# EAGLE design GregsBoard1 (EAGLE 8.6.0)
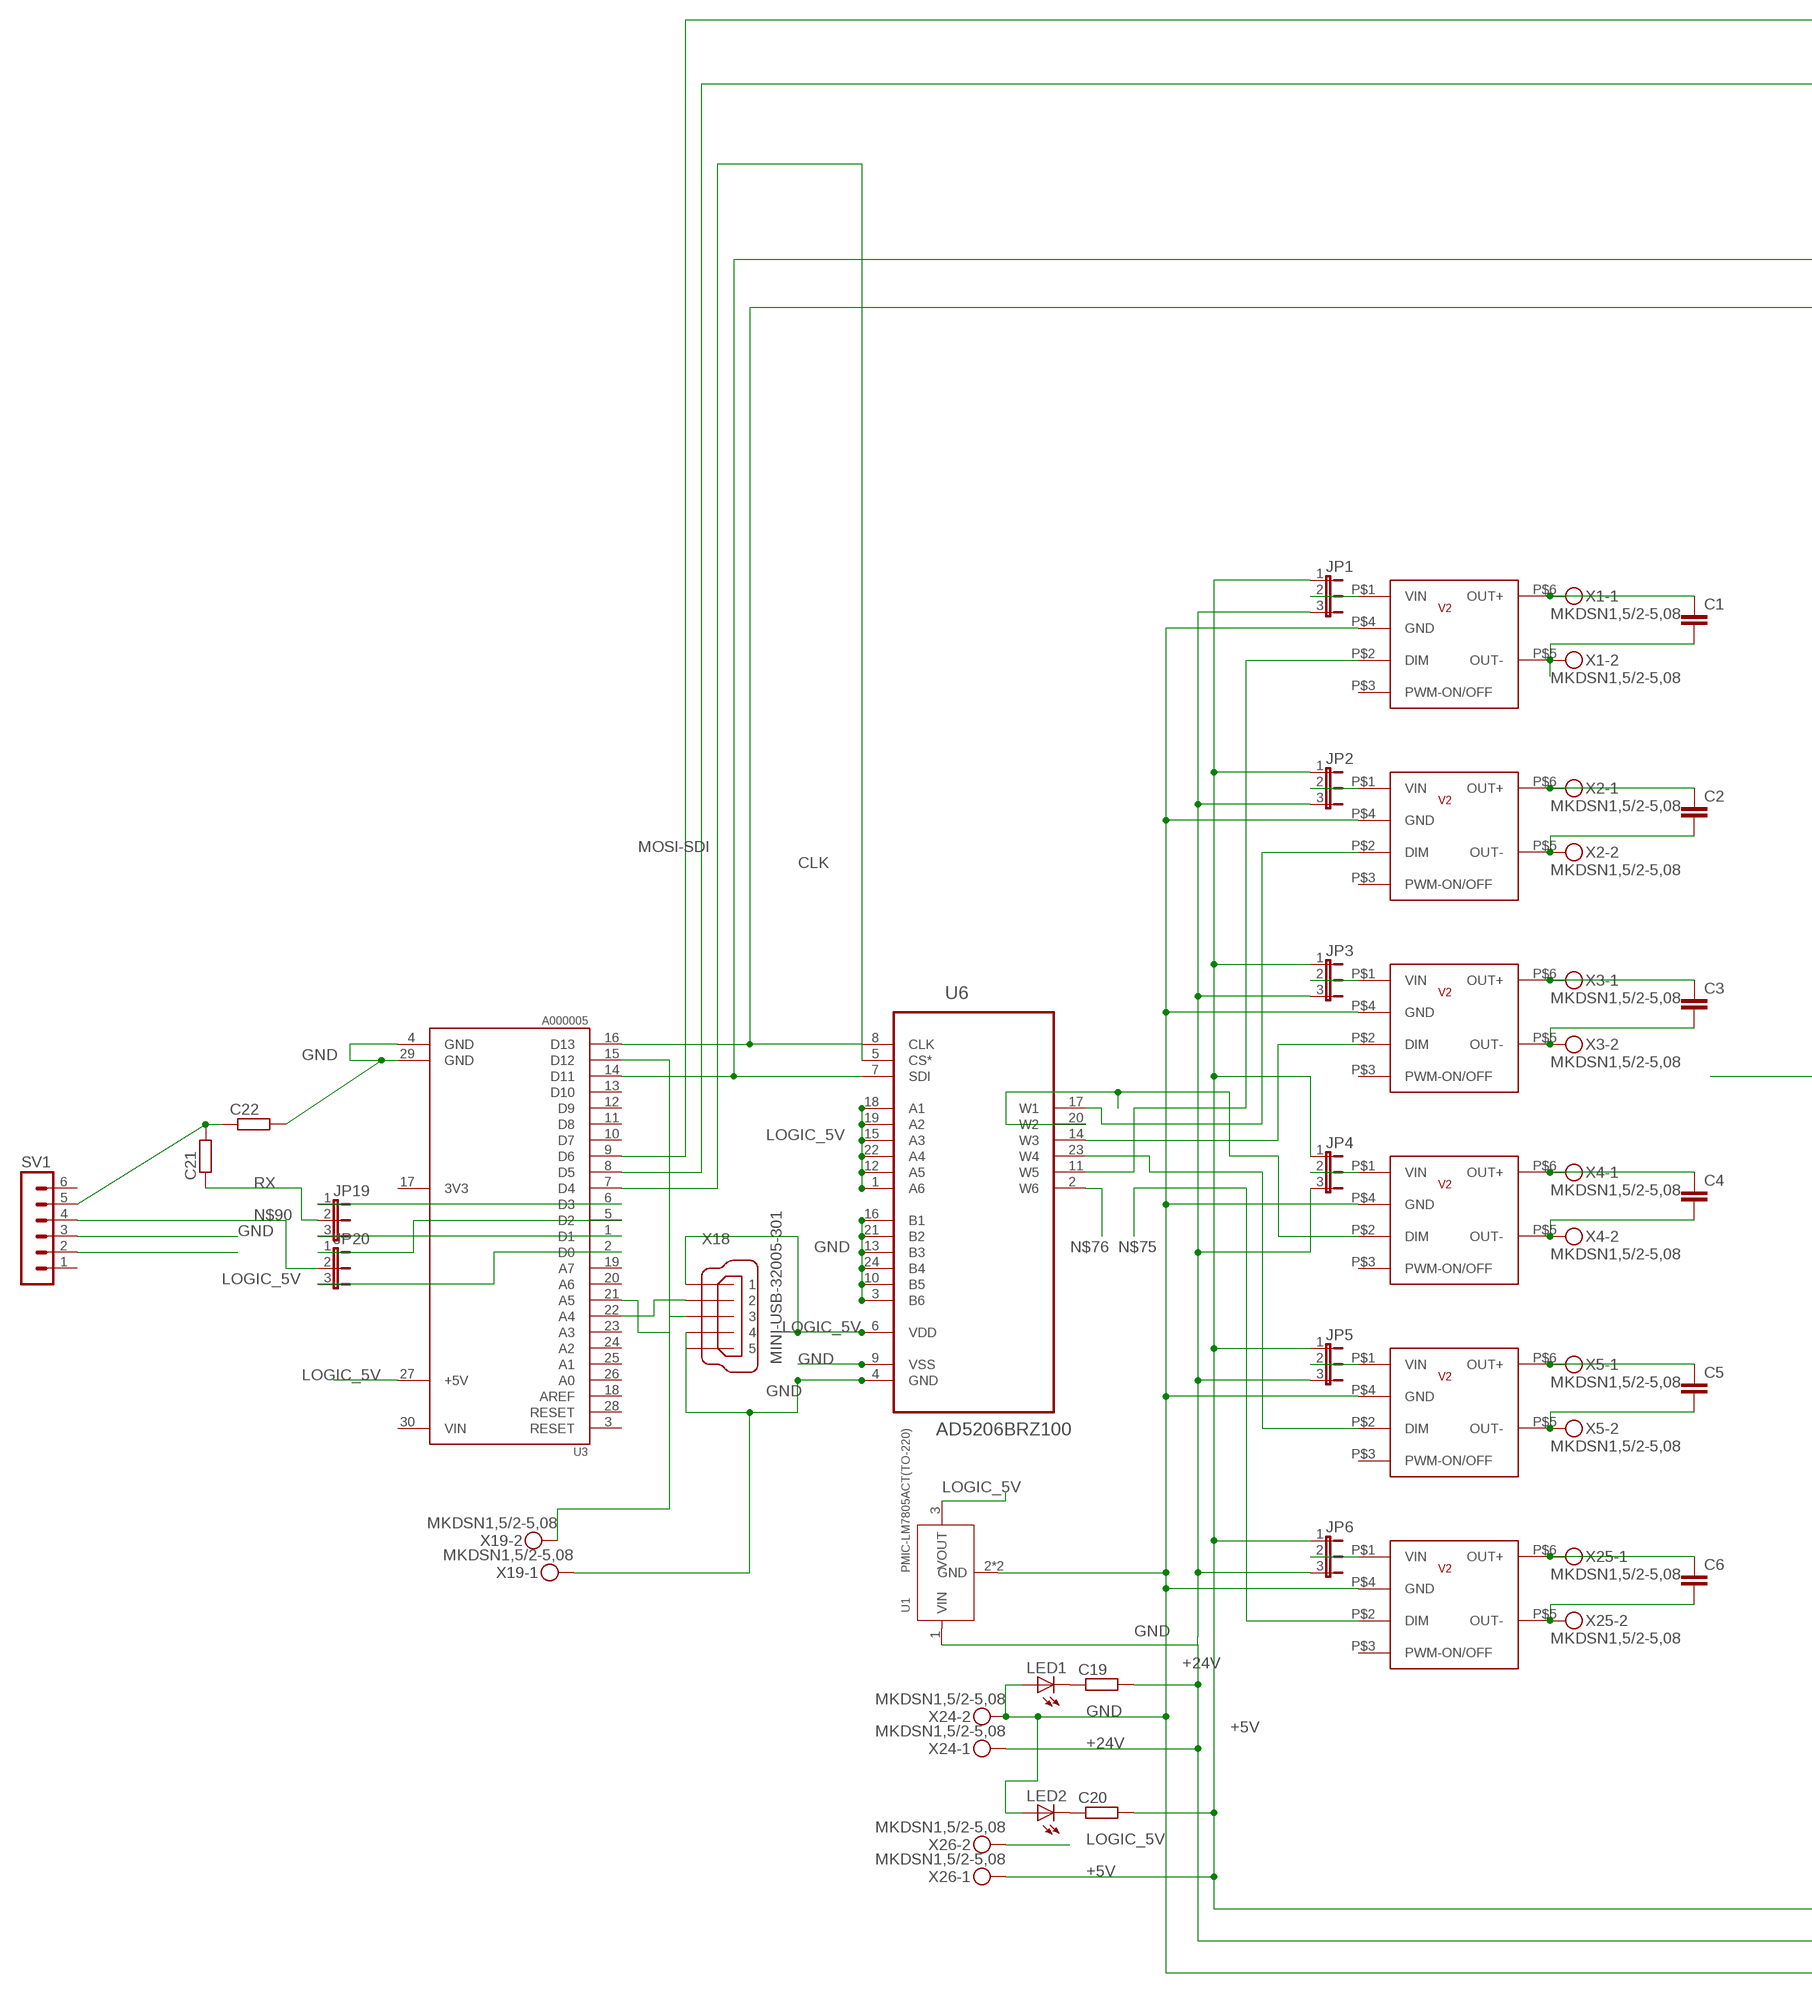
[diagram p0: schematic, sheet 1, part 1 of 2]
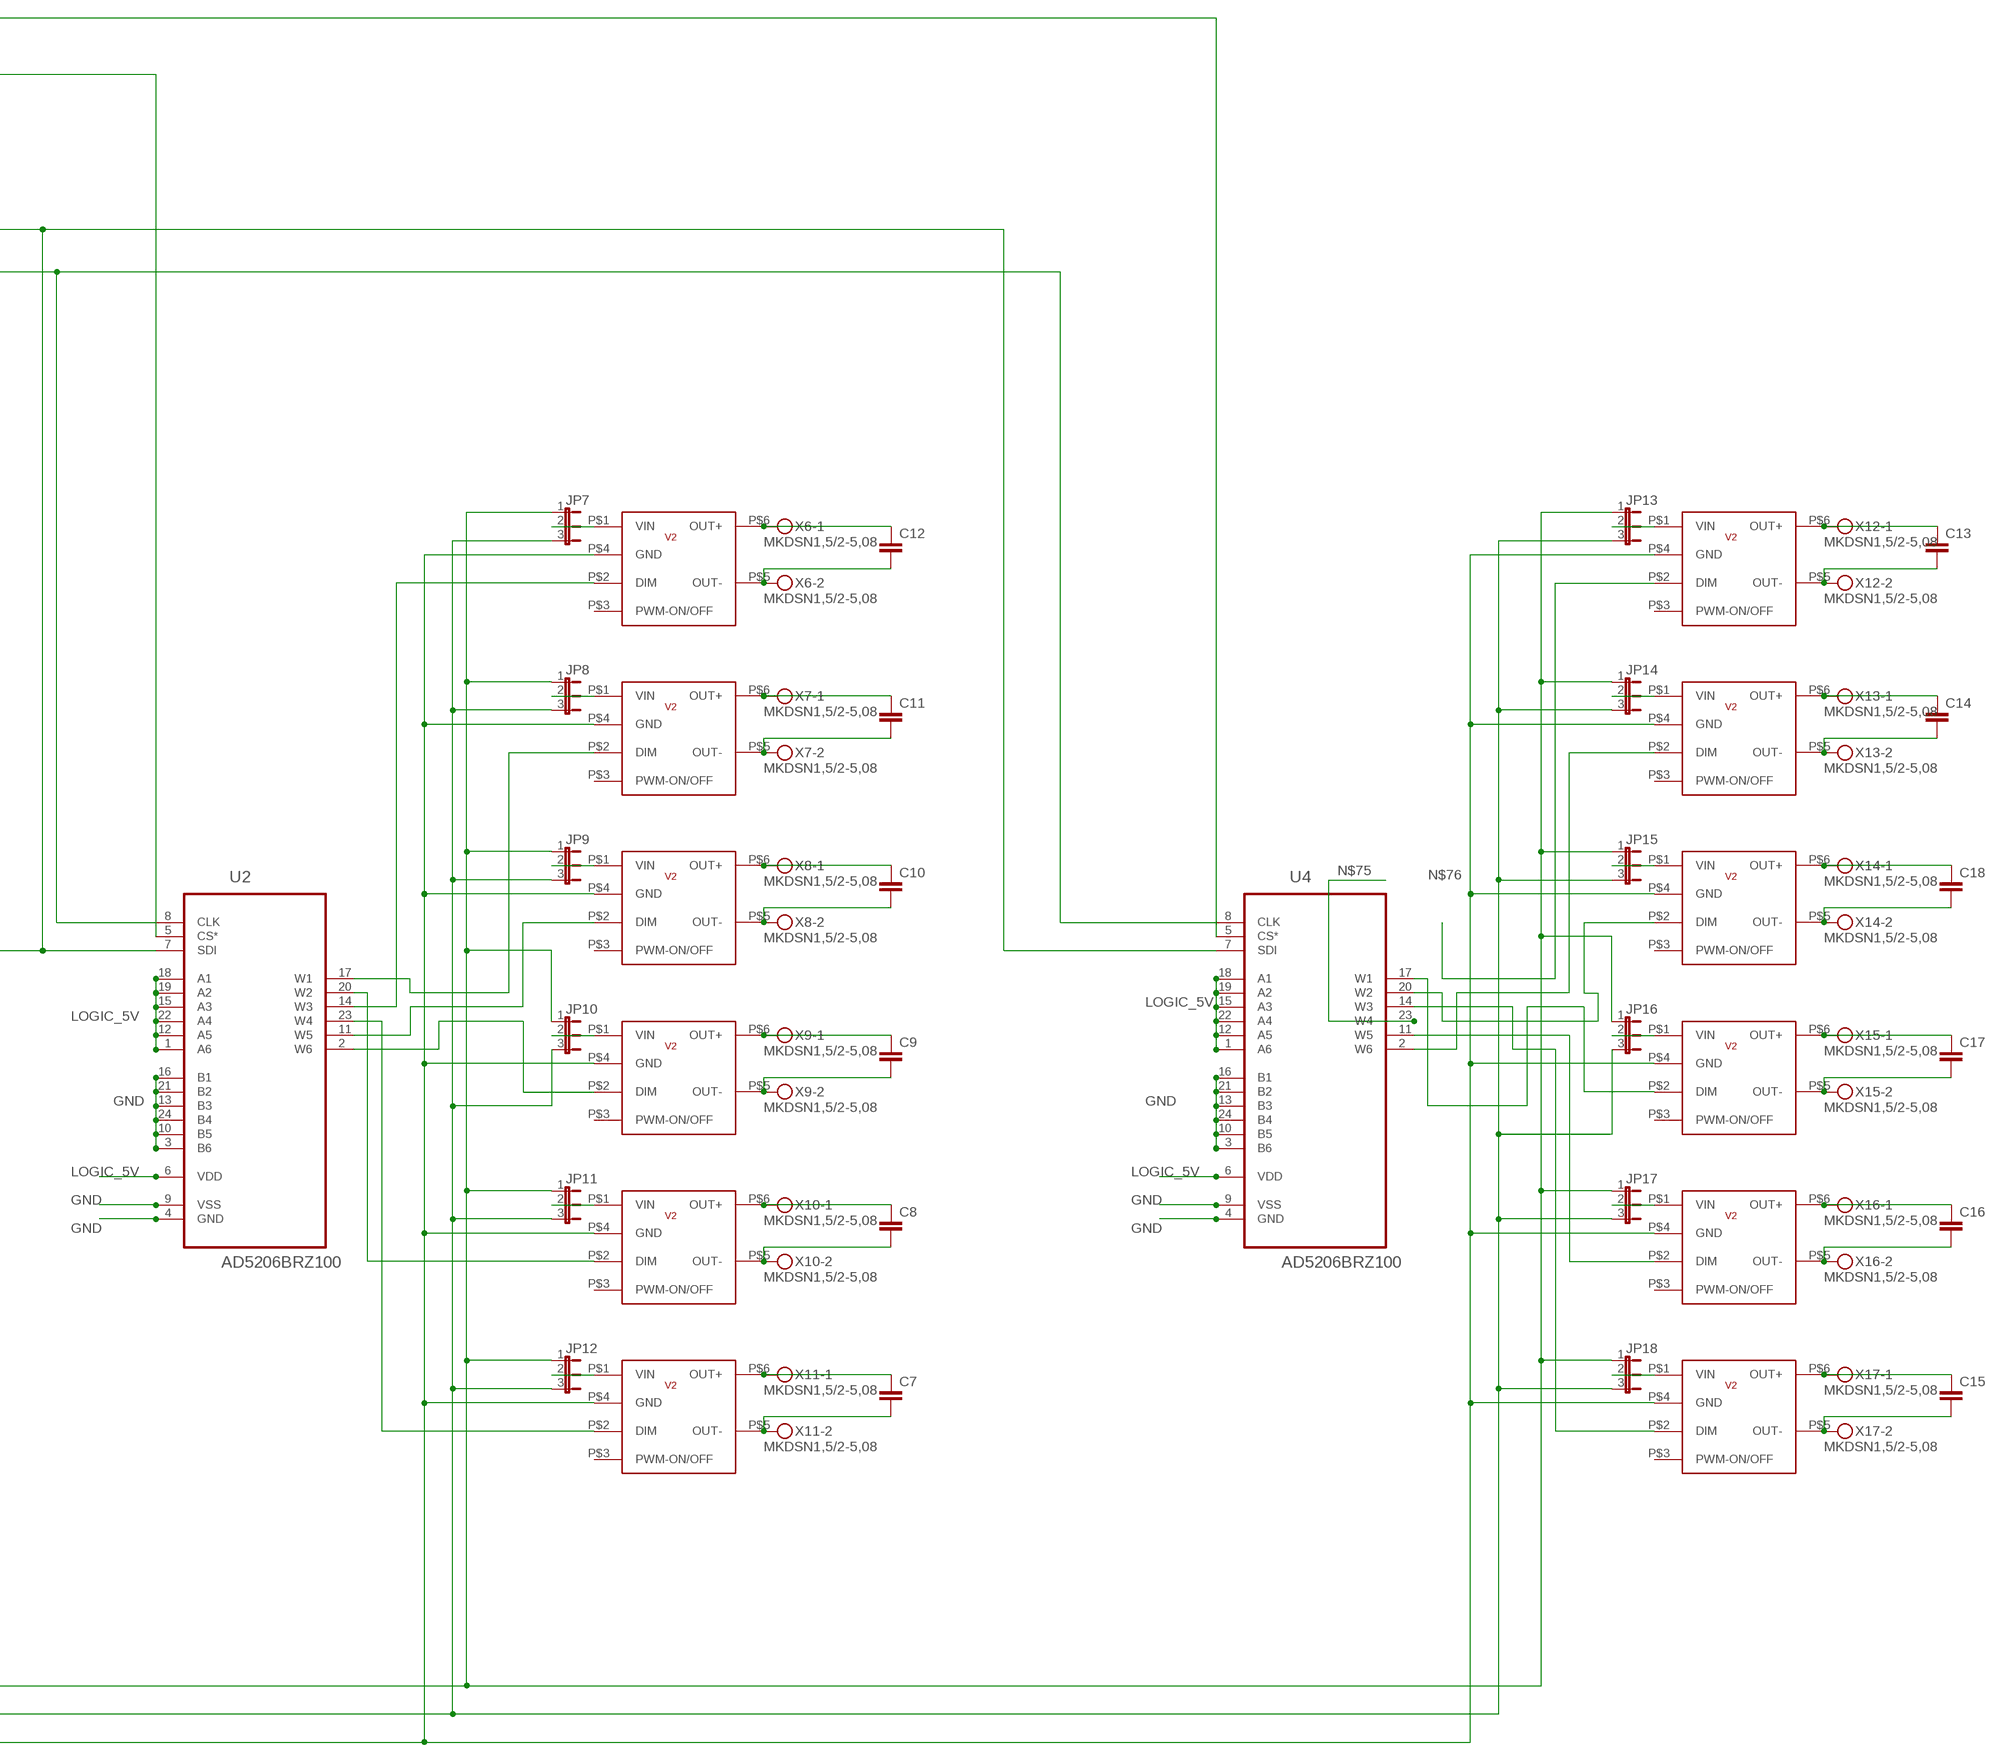
[diagram p1: schematic, sheet 1, part 2 of 2]

## Parts
C1  C-EU050-045X075  [C050-045X075]
C2  C-EU050-045X075  [C050-045X075]
C3  C-EU050-045X075  [C050-045X075]
C4  C-EU050-045X075  [C050-045X075]
C5  C-EU050-045X075  [C050-045X075]
C6  C-EU050-045X075  [C050-045X075]
C7  C-EU050-045X075  [C050-045X075]
C8  C-EU050-045X075  [C050-045X075]
C9  C-EU050-045X075  [C050-045X075]
C10  C-EU050-045X075  [C050-045X075]
C11  C-EU050-045X075  [C050-045X075]
C12  C-EU050-045X075  [C050-045X075]
C13  C-EU050-045X075  [C050-045X075]
C14  C-EU050-045X075  [C050-045X075]
C15  C-EU050-045X075  [C050-045X075]
C16  C-EU050-045X075  [C050-045X075]
C17  C-EU050-045X075  [C050-045X075]
C18  C-EU050-045X075  [C050-045X075]
C19  R-EU_0207/7  [0207/7]
C20  R-EU_0207/7  [0207/7]
C21  R-EU_0207/7  [0207/7]
C22  R-EU_0207/7  [0207/7]
IC1  RCD-24_MY_DEV  [RCD24-DIP]
IC2  RCD-24_MY_DEV  [RCD24-DIP]
IC3  RCD-24_MY_DEV  [RCD24-DIP]
IC4  RCD-24_MY_DEV  [RCD24-DIP]
IC5  RCD-24_MY_DEV  [RCD24-DIP]
IC6  RCD-24_MY_DEV  [RCD24-DIP]
IC7  RCD-24_MY_DEV  [RCD24-DIP]
IC8  RCD-24_MY_DEV  [RCD24-DIP]
IC9  RCD-24_MY_DEV  [RCD24-DIP]
IC10  RCD-24_MY_DEV  [RCD24-DIP]
IC11  RCD-24_MY_DEV  [RCD24-DIP]
IC12  RCD-24_MY_DEV  [RCD24-DIP]
IC13  RCD-24_MY_DEV  [RCD24-DIP]
IC14  RCD-24_MY_DEV  [RCD24-DIP]
IC15  RCD-24_MY_DEV  [RCD24-DIP]
IC16  RCD-24_MY_DEV  [RCD24-DIP]
IC17  RCD-24_MY_DEV  [RCD24-DIP]
IC18  RCD-24_MY_DEV  [RCD24-DIP]
JP1  JP2E  [JP2]
JP2  JP2E  [JP2]
JP3  JP2E  [JP2]
JP4  JP2E  [JP2]
JP5  JP2E  [JP2]
JP6  JP2E  [JP2]
JP7  JP2E  [JP2]
JP8  JP2E  [JP2]
JP9  JP2E  [JP2]
JP10  JP2E  [JP2]
JP11  JP2E  [JP2]
JP12  JP2E  [JP2]
JP13  JP2E  [JP2]
JP14  JP2E  [JP2]
JP15  JP2E  [JP2]
JP16  JP2E  [JP2]
JP17  JP2E  [JP2]
JP18  JP2E  [JP2]
JP19  JP2E  [JP2]
JP20  JP2E  [JP2]
LED1  LEDB152  [Q62902-B152]
LED2  LEDB152  [Q62902-B152]
SV1  MA06-1  [MA06-1]
U1  PMIC-LM7805ACT(TO-220)  [TO-220]
U2  AD5206BRZ100  [SOIC127P1032X265-24N]
U3  A000005  [ARDUINO_A000005]
U4  AD5206BRZ100  [SOIC127P1032X265-24N]
U6  AD5206BRZ100  [SOIC127P1032X265-24N]
X1  MKDSN1,5/2-5,08  [MKDSN1,5/2-5,08]
X2  MKDSN1,5/2-5,08  [MKDSN1,5/2-5,08]
X3  MKDSN1,5/2-5,08  [MKDSN1,5/2-5,08]
X4  MKDSN1,5/2-5,08  [MKDSN1,5/2-5,08]
X5  MKDSN1,5/2-5,08  [MKDSN1,5/2-5,08]
X6  MKDSN1,5/2-5,08  [MKDSN1,5/2-5,08]
X7  MKDSN1,5/2-5,08  [MKDSN1,5/2-5,08]
X8  MKDSN1,5/2-5,08  [MKDSN1,5/2-5,08]
X9  MKDSN1,5/2-5,08  [MKDSN1,5/2-5,08]
X10  MKDSN1,5/2-5,08  [MKDSN1,5/2-5,08]
X11  MKDSN1,5/2-5,08  [MKDSN1,5/2-5,08]
X12  MKDSN1,5/2-5,08  [MKDSN1,5/2-5,08]
X13  MKDSN1,5/2-5,08  [MKDSN1,5/2-5,08]
X14  MKDSN1,5/2-5,08  [MKDSN1,5/2-5,08]
X15  MKDSN1,5/2-5,08  [MKDSN1,5/2-5,08]
X16  MKDSN1,5/2-5,08  [MKDSN1,5/2-5,08]
X17  MKDSN1,5/2-5,08  [MKDSN1,5/2-5,08]
X18  MINI-USB-32005-301  [32005-301]
X19  MKDSN1,5/2-5,08  [MKDSN1,5/2-5,08]
X24  MKDSN1,5/2-5,08  [MKDSN1,5/2-5,08]
X25  MKDSN1,5/2-5,08  [MKDSN1,5/2-5,08]
X26  MKDSN1,5/2-5,08  [MKDSN1,5/2-5,08]

## Nets
+5V: C20.2 JP1.1 JP2.1 JP3.1 JP4.1 JP5.1 JP6.1 JP7.1 JP8.1 JP9.1 JP10.1 JP11.1 JP12.1 JP13.1 JP14.1 JP15.1 JP16.1 JP17.1 JP18.1 X26.1
+24V: C19.2 JP1.3 JP2.3 JP3.3 JP4.3 JP5.3 JP6.3 JP7.3 JP8.3 JP9.3 JP10.3 JP11.3 JP12.3 JP13.3 JP14.3 JP15.3 JP16.3 JP17.3 JP18.3 U1.1(VIN) X24.1
CLK: U2.8(CLK) U3.16(D13) U4.8(CLK) U6.8(CLK)
GND: C22.2 IC1.P$4(GND) IC2.P$4(GND) IC3.P$4(GND) IC4.P$4(GND) IC5.P$4(GND) IC6.P$4(GND) IC7.P$4(GND) IC8.P$4(GND) IC9.P$4(GND) IC10.P$4(GND) IC11.P$4(GND) IC12.P$4(GND) IC13.P$4(GND) IC14.P$4(GND) IC15.P$4(GND) IC16.P$4(GND) IC17.P$4(GND) IC18.P$4(GND) LED1.A LED2.A SV1.3 U1.2(GND) U1.HEAT(GND) U2.3(B6) U2.4(GND) U2.9(VSS) U2.10(B5) U2.13(B3) U2.16(B1) U2.21(B2) U2.24(B4) U3.4(GND) U3.29(GND) U4.3(B6) U4.4(GND) U4.9(VSS) U4.10(B5) U4.13(B3) U4.16(B1) U4.21(B2) U4.24(B4) U6.3(B6) U6.4(GND) U6.9(VSS) U6.10(B5) U6.13(B3) U6.16(B1) U6.21(B2) U6.24(B4) X18.4 X19.1 X24.2
LOGIC_5V: SV1.2 U1.3(VOUT) U2.1(A6) U2.6(VDD) U2.12(A5) U2.15(A3) U2.18(A1) U2.19(A2) U2.22(A4) U3.27(+5V) U4.1(A6) U4.6(VDD) U4.12(A5) U4.15(A3) U4.18(A1) U4.19(A2) U4.22(A4) U6.1(A6) U6.6(VDD) U6.12(A5) U6.15(A3) U6.18(A1) U6.19(A2) U6.22(A4) X18.1 X26.2
MOSI-SDI: U2.7(SDI) U3.14(D11) U4.7(SDI) U6.7(SDI)
N$1: C6.1 IC1.P$6(OUT+) X25.1
N$2: C6.2 IC1.P$5(OUT-) X25.2
N$3: C1.1 IC2.P$6(OUT+) X1.1
N$4: C1.2 IC2.P$5(OUT-) X1.2
N$5: C2.1 IC3.P$6(OUT+) X2.1
N$6: C2.2 IC3.P$5(OUT-) X2.2
N$7: C3.1 IC4.P$6(OUT+) X3.1
N$8: C3.2 IC4.P$5(OUT-) X3.2
N$9: C4.1 IC5.P$6(OUT+) X4.1
N$10: C4.2 IC5.P$5(OUT-) X4.2
N$11: C5.1 IC6.P$6(OUT+) X5.1
N$12: C5.2 IC6.P$5(OUT-) X5.2
N$13: IC2.P$2(DIM) U6.11(W5)
N$14: IC3.P$2(DIM) U6.17(W1)
N$15: IC4.P$2(DIM) U6.14(W3)
N$16: IC5.P$2(DIM) U6.20(W2)
N$17: IC6.P$2(DIM) U6.23(W4)
N$18: U3.22(A4) X18.2
N$19: IC2.P$1(VIN) JP1.2
N$20: IC3.P$1(VIN) JP2.2
N$21: IC4.P$1(VIN) JP3.2
N$22: IC5.P$1(VIN) JP4.2
N$23: IC6.P$1(VIN) JP5.2
N$24: IC1.P$1(VIN) JP6.2
N$25: U3.7(D4) U6.5(CS*)
N$26: U2.5(CS*) U3.8(D5)
N$27: C12.1 IC7.P$6(OUT+) X6.1
N$28: C12.2 IC7.P$5(OUT-) X6.2
N$29: C11.1 IC8.P$6(OUT+) X7.1
N$30: C11.2 IC8.P$5(OUT-) X7.2
N$31: C10.1 IC9.P$6(OUT+) X8.1
N$32: C10.2 IC9.P$5(OUT-) X8.2
N$33: C9.1 IC10.P$6(OUT+) X9.1
N$34: C9.2 IC10.P$5(OUT-) X9.2
N$35: C8.1 IC11.P$6(OUT+) X10.1
N$36: C8.2 IC11.P$5(OUT-) X10.2
N$37: C7.1 IC12.P$6(OUT+) X11.1
N$38: C7.2 IC12.P$5(OUT-) X11.2
N$39: IC7.P$2(DIM) U2.14(W3)
N$40: IC8.P$2(DIM) U2.17(W1)
N$41: IC9.P$2(DIM) U2.11(W5)
N$42: IC10.P$2(DIM) U2.2(W6)
N$43: IC11.P$2(DIM) U2.20(W2)
N$44: IC12.P$2(DIM) U2.23(W4)
N$45: IC7.P$1(VIN) JP7.2
N$46: IC8.P$1(VIN) JP8.2
N$47: IC9.P$1(VIN) JP9.2
N$48: IC10.P$1(VIN) JP10.2
N$49: IC11.P$1(VIN) JP11.2
N$50: IC12.P$1(VIN) JP12.2
N$51: U3.9(D6) U4.5(CS*)
N$52: C18.1 IC15.P$6(OUT+) X14.1
N$53: C13.1 IC13.P$6(OUT+) X12.1
N$54: C13.2 IC13.P$5(OUT-) X12.2
N$55: C14.1 IC14.P$6(OUT+) X13.1
N$56: C14.2 IC14.P$5(OUT-) X13.2
N$57: C18.2 IC15.P$5(OUT-) X14.2
N$58: C17.1 IC16.P$6(OUT+) X15.1
N$59: C17.2 IC16.P$5(OUT-) X15.2
N$60: U3.15(D12) X19.2
N$61: C16.1 IC17.P$6(OUT+) X16.1
N$62: C16.2 IC17.P$5(OUT-) X16.2
N$63: C15.1 IC18.P$6(OUT+) X17.1
N$64: C15.2 IC18.P$5(OUT-) X17.2
N$65: U3.21(A5) X18.3
N$66: IC14.P$2(DIM) U4.2(W6)
N$67: IC15.P$2(DIM) U4.20(W2)
N$68: IC16.P$2(DIM) U4.17(W1)
N$69: IC17.P$2(DIM) U4.11(W5)
N$70: IC18.P$2(DIM) U4.14(W3)
N$71: IC13.P$1(VIN) JP13.2
N$72: IC14.P$1(VIN) JP14.2
N$73: C19.1 LED1.K(C)
N$74: C20.1 LED2.K(C)
N$75: IC1.P$2(DIM) U4.23(W4)
N$76: IC13.P$2(DIM) U6.2(W6)
N$77: IC15.P$1(VIN) JP15.2
N$78: IC16.P$1(VIN) JP16.2
N$79: IC17.P$1(VIN) JP17.2
N$80: IC18.P$1(VIN) JP18.2
N$81: JP19.3 U3.1(D1)
N$87: JP19.1 U3.6(D3)
N$88: C21.1 JP19.2
N$89: JP20.1 U3.5(D2)
N$90: JP20.2 SV1.4
RX: C21.2 C22.1 SV1.5
TX: JP20.3 U3.2(D0)
Unconnected: IC1.P$3(PWM-ON/OFF) IC2.P$3(PWM-ON/OFF) IC3.P$3(PWM-ON/OFF) IC4.P$3(PWM-ON/OFF) IC5.P$3(PWM-ON/OFF) IC6.P$3(PWM-ON/OFF) IC7.P$3(PWM-ON/OFF) IC8.P$3(PWM-ON/OFF) IC9.P$3(PWM-ON/OFF) IC10.P$3(PWM-ON/OFF) IC11.P$3(PWM-ON/OFF) IC12.P$3(PWM-ON/OFF) IC13.P$3(PWM-ON/OFF) IC14.P$3(PWM-ON/OFF) IC15.P$3(PWM-ON/OFF) IC16.P$3(PWM-ON/OFF) IC17.P$3(PWM-ON/OFF) IC18.P$3(PWM-ON/OFF) SV1.1 SV1.6 U3.3(RESET) U3.10(D7) U3.11(D8) U3.12(D9) U3.13(D10) U3.17(3V3) U3.18(AREF) U3.19(A7) U3.20(A6) U3.23(A3) U3.24(A2) U3.25(A1) U3.26(A0) U3.28(RESET) X18.5

## Power pins joined to a net without a drawn wire
VIN: U3.30(VIN)

## Library data of the parts
C1-C18 = resistor:C-EU: CAPACITOR, European symbol
C19-C22 = resistor:R-EU_: RESISTOR, European symbol
IC1-IC18 = RCD-Custom1:RCD-24_MY_DEV
JP1-JP20 = jumper:JP2E: JUMPER
LED1 LED2 = led:LED: LED OSRAM: - CHIPLED LG R971, LG N971, LY N971, LG Q971, LY Q971, LO R971, LY R971 LH N974, LH R974 LS Q976, LO Q976, LY Q976 LO Q996 - Hyper CHIPLED LW Q18S LB Q993, LB Q99A, LB R99A - SideLED LS A670, LO A670, LY A670, LG A670, LP A670 LB A673, LV A673, LT A673, LW A673 LH A674 LY A675 LS A676, LA A676, LO A676, LY A676, LW A676 LS A679, LY A679, LG A679 - Hyper Micro SIDELED® LS Y876, LA Y876, LO Y876, LY Y876 LT Y87S - SmartLED LW L88C, LW L88S LB L89C, LB L89S, LG L890 LS L89K, LO L89K, LY L89K LS L896, LA L896, LO L896, LY L896 - TOPLED LS T670, LO T670, LY T670, LG T670, LP T670 LSG T670, LSP T670, LSY T670, LOP T670, LYG T670 LG T671, LOG T671, LSG T671 LB T673, LV T673, LT T673, LW T673 LH T674 LS T676, LA T676, LO T676, LY T676, LB T676, LH T676, LSB T676, LW T676 LB T67C, LV T67C, LT T67C, LS T67K, LO T67K, LY T67K, LW E67C LS E67B, LA E67B, LO E67B, LY E67B, LB E67C, LV E67C, LT E67C LW T67C LS T679, LY T679, LG T679 LS T770, LO T770, LY T770, LG T770, LP T770 LB T773, LV T773, LT T773, LW T773 LH T774 LS E675, LA E675, LY E675, LS T675 LS T776, LA T776, LO T776, LY T776, LB T776 LHGB T686 LT T68C, LB T68C - Hyper Mini TOPLED® LB M676 - Mini TOPLED Santana® LG M470 LS M47K, LO M47K, LY M47K Source: http://www.osram.convergy.de LUXEON: - LUMILED® LXK2-PW12-R00, LXK2-PW12-S00, LXK2-PW14-U00, LXK2-PW14-V00 LXK2-PM12-R00, LXK2-PM12-S00, LXK2-PM14-U00 LXK2-PE12-Q00, LXK2-PE12-R00, LXK2-PE12-S00, LXK2-PE14-T00, LXK2-PE14-U00 LXK2-PB12-K00, LXK2-PB12-L00, LXK2-PB12-M00, LXK2-PB14-N00, LXK2-PB14-P00, LXK2-PB14-Q00 LXK2-PR12-L00, LXK2-PR12-M00, LXK2-PR14-Q00, LXK2-PR14-R00 LXK2-PD12-Q00, LXK2-PD12-R00, LXK2-PD12-S00 LXK2-PH12-R00, LXK2-PH12-S00 LXK2-PL12-P00, LXK2-PL12-Q00, LXK2-PL12-R00 Source: www.luxeon.com KINGBRIGHT: KA-3528ASYC Source: www.kingbright.com
SV1 = con-lstb:MA06-1: PIN HEADER; OC_FARNELL: unknown; OC_NEWARK: unknown
U1 = PMIC-LM7805ACT_TO-220_:PMIC-LM7805ACT(TO-220): 310030049; AVAILABILITY: Good; DESCRIPTION: IC REG LINEAR 5V 1A TO220-3; MF: ON Semiconductor; MP: LM7805ACT; PACKAGE: TO-220 ON Semiconductor; PRICE: 0.50 USD
U2 U4 U6 = AD5206BRZ100:AD5206BRZ100: 4-Channel Digital Potentiometer; AVAILABILITY: Good; DESCRIPTION: IC DGTL POT 256POS 100K 24SOIC; MF: Analog; MP: AD5206BRZ100; PACKAGE: SOIC-24 Analog Devices; PRICE: 4.11 USD
U3 = A000005:A000005: MICRO, ARDUINO NANO 3.0, MINI-B USB, ATmega328, 0.1"DIP, ICSP HDR; AVAILABILITY: Warning; DESCRIPTION: ARDUINO NANO BOARD; MF: Arduino; MP: A000005; PACKAGE: None; PRICE: 22.80 USD
X1-X17 X19 X24-X26 = con-phoenix-508:MKDSN1,5/2-5,08: MKDSN 1,5/ 2-5,08 Printklemme Nennstrom: 13,5 A Nennspannung: 250 V Rastermaß: 5,08 mm Polzahl: 2 Anschlussart: Schraubanschluss Montage: Löten Anschlussrichtung Leiter/Platine: 0 ° Artikelnummer: 1729128 Source: http://eshop.phoenixcontact.com .. 1729128.pdf
X18 = con-cypressindustries:MINI-USB-: MINI USB-B Conector Source: www.cypressindustries.com; OC_FARNELL: unknown; OC_NEWARK: unknown

## Net classes
0 default: width 0.3 mm
1 +24V: width 0.8 mm
2 GND: width 0.8 mm

## Board
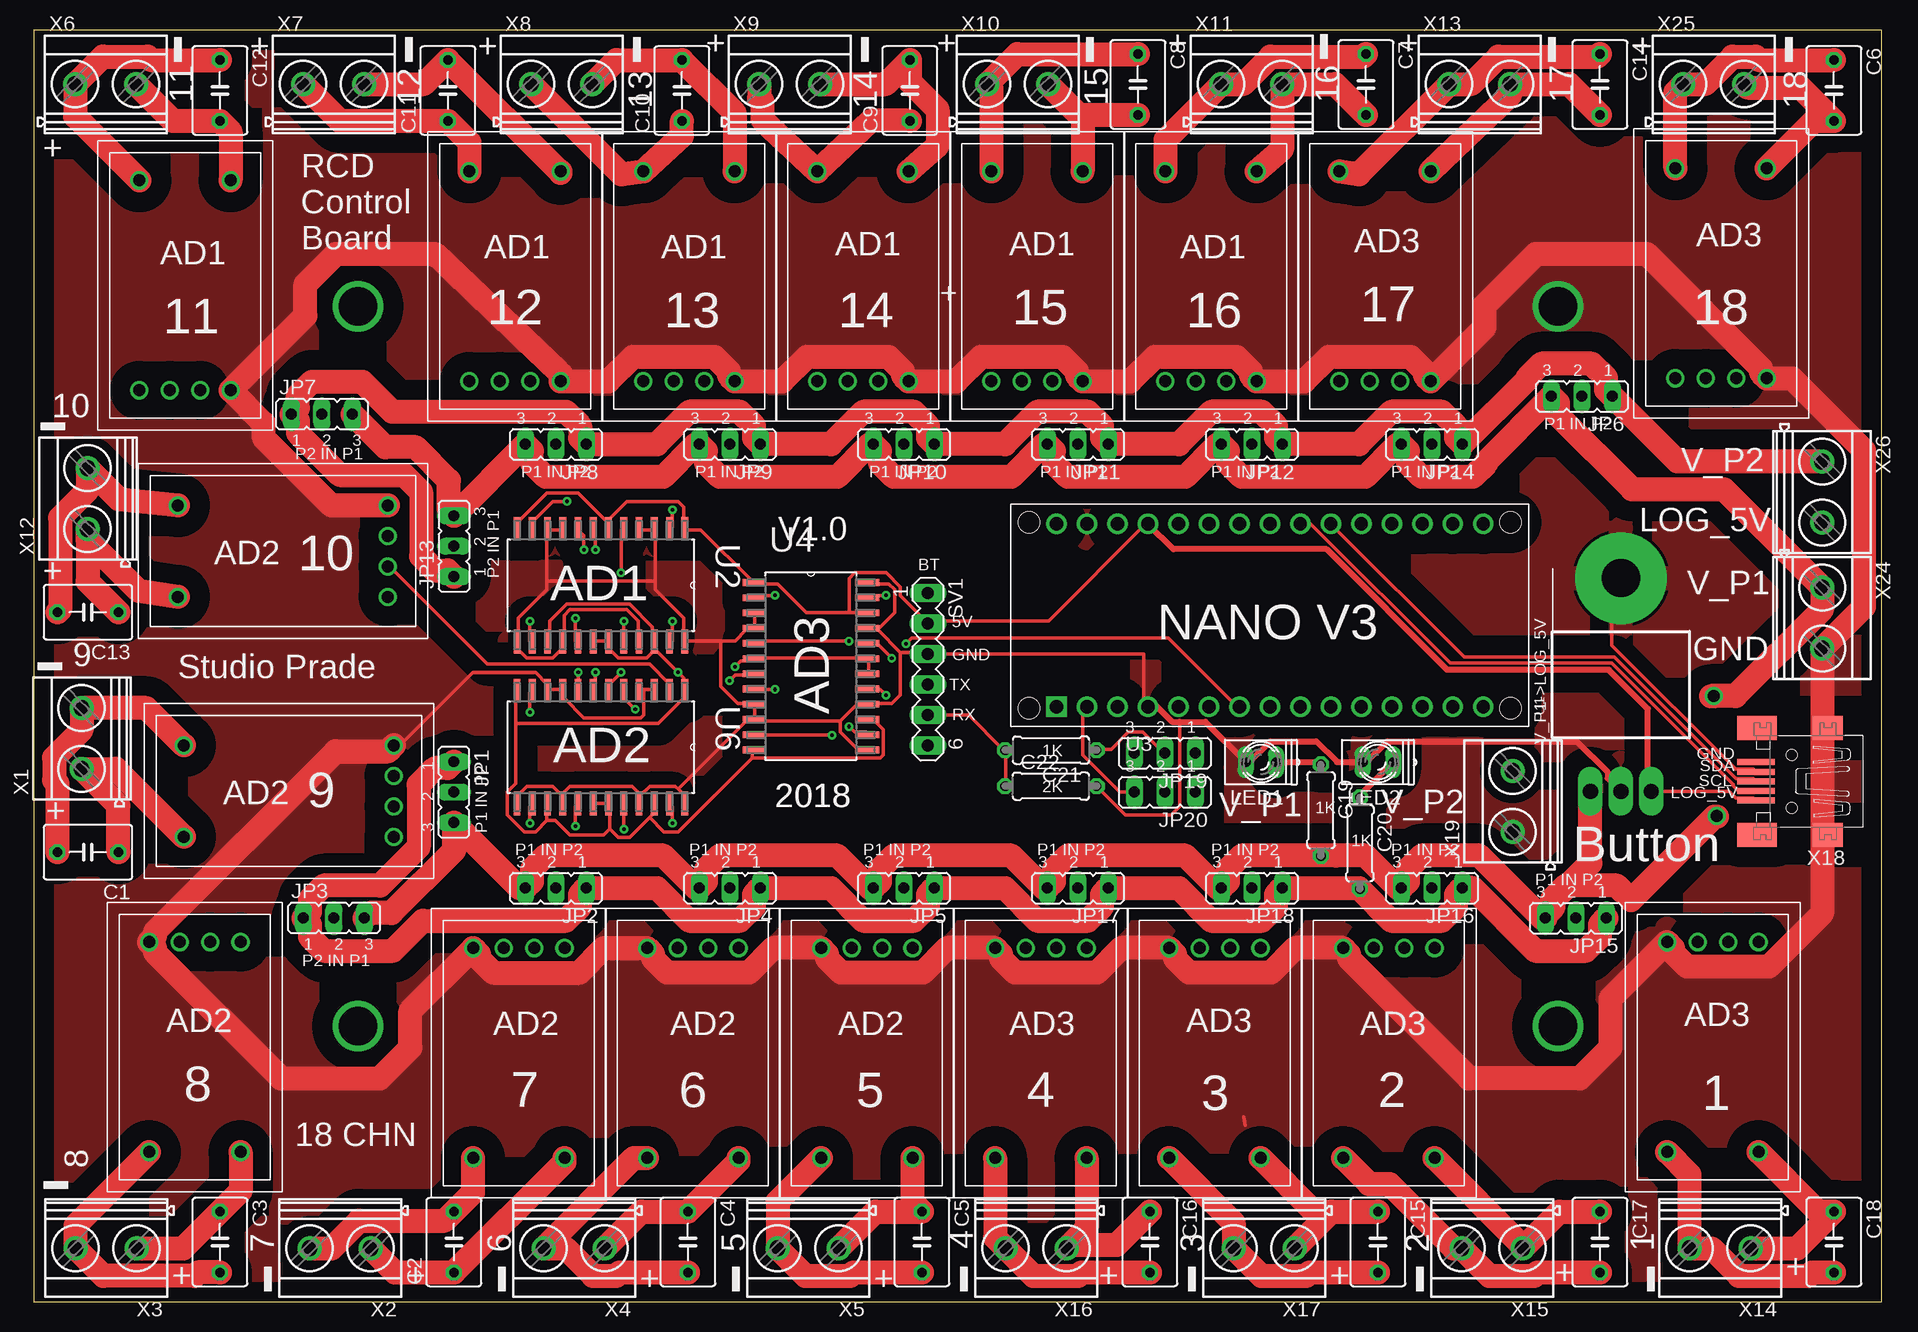
[diagram p2: board, top side]
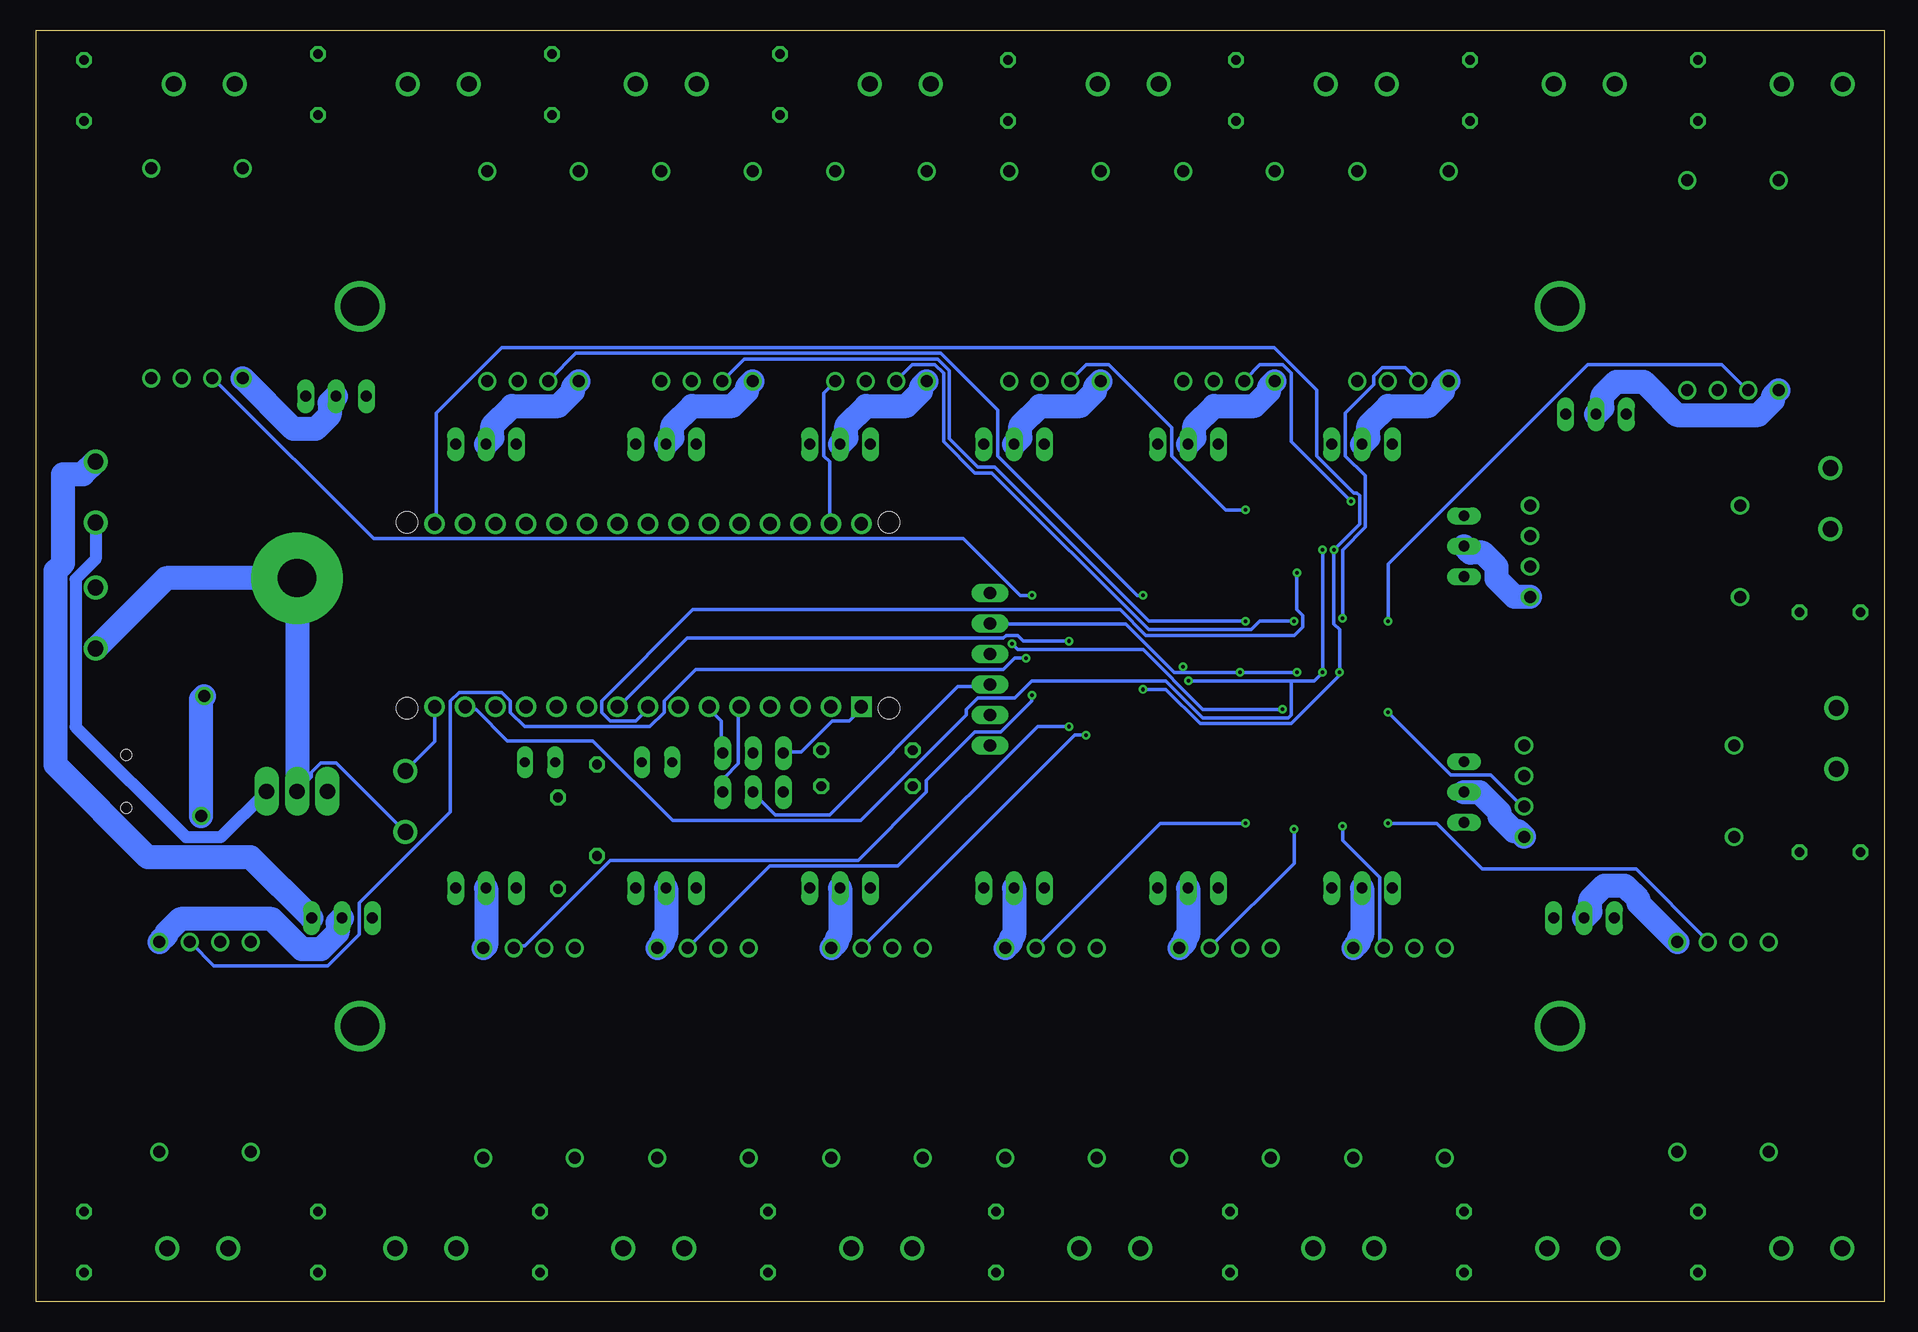
[diagram p3: board, bottom side, seen from below]

Size 154 x 106 mm. Coordinates in mm from the lower left corner, seen from the top.
Outline: 0,0 154,0 154,106 0,106 0,0
Copper layers (1*16): Top 0.07mm / dielectric 1.5mm / Bottom 0.07mm
Design rules "Enigma *": minimum track width 0.3mm, minimum drill 0.3mm, track to track 0.175mm, track to pad 0.175mm, pad to pad 0.175mm, via to via 0.175mm, smd to smd 0.175mm, copper to edge 0.175mm, drill to drill 0.175mm, minimum pad ring 10mil, minimum via ring 8mil, stop-mask expansion 4mil, vias tented up to drill 0mil, thermal gap 10mil

### Footprints (pad centres in the part's own frame; a part is rotated, then mirrored left to right if it is on the bottom)
C050-045X075 = drill 0.813 octagon: 1 -2.54,0; 2 2.54,0
0207/7 = drill 0.813 octagon: 1 -3.81,0; 2 3.81,0
RCD24-DIP = drill 1: P$1 -9,3.72; P$2 -9,1.18; P$3 -9,-1.36; P$4 -9,-3.9; P$5 8.5,-3.9; P$6 8.5,3.72
JP2 = drill 0.914 long: 1 -2.54,0; 2 0,0; 3 2.54,0
Q62902-B152 = drill 0.813 long: A 1.27,0; K -1.27,0
MA06-1 = drill 1.016 long: 1 -6.35,0; 2 -3.81,0; 3 -1.27,0; 4 1.27,0; 5 3.81,0; 6 6.35,0
TO-220 = drill 1.27 pad 2.032 long: 1 -2.54,-11.43; 2 0,-11.43; 3 2.54,-11.43 | drill 3.2 pad 7.62: HEAT 0,6.35
SOIC127P1032X265-24N = smd 1.981 x 0.559: 1 -4.699,6.985; 2 -4.699,5.715; 3 -4.699,4.445; 4 -4.699,3.175; 5 -4.699,1.905; 6 -4.699,0.635; 7 -4.699,-0.635; 8 -4.699,-1.905; 9 -4.699,-3.175; 10 -4.699,-4.445; 11 -4.699,-5.715; 12 -4.699,-6.985; 13 4.699,-6.985; 14 4.699,-5.715; 15 4.699,-4.445; 16 4.699,-3.175; 17 4.699,-1.905; 18 4.699,-0.635; 19 4.699,0.635; 20 4.699,1.905; 21 4.699,3.175; 22 4.699,4.445; 23 4.699,5.715; 24 4.699,6.985
ARDUINO_A000005 = drill 1.1 pad 1.7 square: 1 -7.62,17.78 | drill 1.1 pad 1.7: 2 -7.62,15.24; 3 -7.62,12.7; 4 -7.62,10.16; 5 -7.62,7.62; 6 -7.62,5.08; 7 -7.62,2.54; 8 -7.62,0; 9 -7.62,-2.54; 10 -7.62,-5.08; 11 -7.62,-7.62; 12 -7.62,-10.16; 13 -7.62,-12.7; 14 -7.62,-15.24; 15 -7.62,-17.78; 16 7.62,-17.78; 17 7.62,-15.24; 18 7.62,-12.7; 19 7.62,-10.16; 20 7.62,-7.62; 21 7.62,-5.08; 22 7.62,-2.54; 23 7.62,0; 24 7.62,2.54; 25 7.62,5.08; 26 7.62,7.62; 27 7.62,10.16; 28 7.62,12.7; 29 7.62,15.24; 30 7.62,17.78 | hole 1.778: -7.747,-20.066; 7.747,-20.066; -7.747,20.066; 7.747,20.066
MKDSN1,5/2-5,08 = drill 1.3 pad 2: 1 -2.561,0.025; 2 2.519,0.025
32005-301 = smd 3.1 x 0.5: 1 3,1.6; 2 3,0.8; 3 3,0; 4 3,-0.8; 5 3,-1.6 | smd 2.5 x 2: M1 -3,-4.45; M2 -3,4.45 | smd 3.3 x 2: M3 2.9,4.45; M4 2.9,-4.45 | hole 0.9: 0,2.2; 0,-2.2

### Placement (x,y rotation side)
C1  4.5,37.5 180 top
C2  35,5 90 top
C3  15.5,5 270 top
C4  54.5,5 270 top
C5  74,5 270 top
C6  150,101 270 top
C7  111,101.5 270 top
C8  92,101.5 270 top
C9  73,101 90 top
C10  54,101 90 top
C11  34.5,101 90 top
C12  15.5,101 270 top
C13  4.5,57.5 180 top
C14  130.5,101.5 270 top
C15  112,5 270 top
C16  93,5 270 top
C17  130.5,5 270 top
C18  150,5 270 top
C19  107.25,41 270 top
C20  110.5,38.25 270 top
C21  84.75,46 180 top
C22  84.75,43 0 top
IC1  140.5,86 90 top
IC2  21,42.5 180 top
IC3  40.5,20.5 270 top
IC4  13.5,21 270 top
IC5  55,20.5 270 top
IC6  69.5,20.5 270 top
IC7  12.5,85 90 top
IC8  40,85.75 90 top
IC9  54.5,85.75 90 top
IC10  69,85.75 90 top
IC11  83.5,85.75 90 top
IC12  98,85.75 90 top
IC13  20.5,62.5 180 top
IC14  112.5,85.75 90 top
IC15  140,21 270 top
IC16  113,20.5 270 top
IC17  84,20.5 270 top
IC18  98.5,20.5 270 top
JP1  35,42.5 270 top
JP2  43.5,34.5 180 top
JP3  25,32 0 top
JP4  58,34.5 180 top
JP5  72.5,34.5 180 top
JP6  129,75.5 180 top
JP7  24,74 0 top
JP8  43.5,71.5 180 top
JP9  58,71.5 180 top
JP10  72.5,71.5 180 top
JP11  87,71.5 180 top
JP12  101.5,71.5 180 top
JP13  35,63 90 top
JP14  116.5,71.5 180 top
JP15  128.5,32 180 top
JP16  116.5,34.5 180 top
JP17  87,34.5 180 top
JP18  101.5,34.5 180 top
JP19  94.25,45.75 180 top
JP20  94.25,42.5 180 top
LED1  102.25,45 180 top
LED2  112,45 180 top
SV1  74.5,52.75 270 top
U1  132.25,54 0 top
U2  47.25,59.75 270 top
U3  103,57.25 90 top
U4  64.75,53 0 top
U6  47.25,46.25 270 top
X1  4,47 90 top
X2  25.5,4.5 180 top
X3  6,4.5 180 top
X4  45,4.5 180 top
X5  64.5,4.5 180 top
X6  6,101.5 0 top
X7  25,101.5 0 top
X8  44,101.5 0 top
X9  63,101.5 0 top
X10  82,101.5 0 top
X11  101.5,101.5 0 top
X12  4.5,67 90 top
X13  120.5,101.5 0 top
X14  140.5,4.5 180 top
X15  121.5,4.5 180 top
X16  83.5,4.5 180 top
X17  102.5,4.5 180 top
X18  146.5,43.4 180 top
X19  123.25,41.75 90 top
X24  149,57 270 top
X25  140,101.5 0 top
X26  149,67.5 270 top

### Tracks (layer width: path | path; a pad name or v marks a point on that pad's centre or on a via)
+5V
  Top 0.5: 109.25,34.5 109.31,34.44 C20.2
  Top 2: JP1.1 34.47,44.51 33.46,44.51 32.05,43.11 32.05,37.93 28.85,34.72 24.17,34.72 22.99,33.54 22.99,32.53 JP3.1 22.99,31.47 22.99,30.46 24.17,29.28 29.91,29.28 32.41,31.78 44.33,31.78 45.51,32.96 45.51,33.97 JP2.1 51.91,34.5 54.63,31.78 58.83,31.78 60.01,32.96 60.01,33.97 JP4.1 66.41,34.5 69.13,31.78 73.33,31.78 74.51,32.96 74.51,33.97 JP5.1 80.91,34.5 83.63,31.78 87.83,31.78 89.01,32.96 89.01,33.97 JP17.1 95.41,34.5 98.13,31.78 102.33,31.78 103.51,32.96 103.51,33.97 JP18.1 109.25,34.5 110.41,34.5 113.13,31.78 117.33,31.78 118.51,32.96 118.51,33.97 JP16.1 119.91,34.5 125.13,29.28 129.33,29.28 130.51,30.46 130.51,31.47 JP15.1 | JP13.1 34.47,60.99 33.46,60.99 32.28,62.17 32.28,67.53 30.85,68.95 25.49,68.95 21.99,72.46 21.99,73.47 JP7.1 21.99,74.53 21.99,75.54 23.17,76.72 27.37,76.72 29.87,74.22 44.33,74.22 45.51,73.04 45.51,72.03 JP8.1 51.91,71.5 54.63,74.22 58.83,74.22 60.01,73.04 60.01,72.03 JP9.1 66.41,71.5 69.13,74.22 73.33,74.22 74.51,73.04 74.51,72.03 JP10.1 80.91,71.5 83.63,74.22 87.83,74.22 89.01,73.04 89.01,72.03 JP11.1 95.41,71.5 98.13,74.22 102.33,74.22 103.51,73.04 103.51,72.03 JP12.1 110.41,71.5 113.13,74.22 117.33,74.22 118.51,73.04 118.51,72.03 JP14.1 124.45,76.91 124.45,77.04 125.63,78.22 129.83,78.22 131.01,77.04 131.01,76.03 JP6.1 136.98,70.06 X26.1
  Bottom 2: JP15.1 136.12,37.08 144.67,37.08 152.38,44.78 152.38,60.95 151.75,61.57 151.75,69 150.09,69 X26.1
+24V  (via drill 1)
  Top 0.3: 140.05,40.45 140,40.5 v140.25,40.5
  Top 0.5: 108.5,37.22 108.47,37.19 C19.2
  Top 2: 125.66,32 JP15.3 | 125.66,32 120.44,37.22 115.67,37.22 114.49,36.04 114.49,35.03 JP16.3 113.66,34.5 110.94,37.22 108.5,37.22 100.67,37.22 99.49,36.04 99.49,35.03 JP18.3 98.66,34.5 95.94,37.22 86.17,37.22 84.99,36.04 84.99,35.03 JP17.3 84.16,34.5 81.44,37.22 71.67,37.22 70.49,36.04 70.49,35.03 JP5.3 69.66,34.5 66.94,37.22 57.17,37.22 55.99,36.04 55.99,35.03 JP4.3 55.16,34.5 52.44,37.22 42.67,37.22 41.49,36.04 41.49,35.03 JP2.3 40.46,34.5 JP1.3 35,37.62 29.8,32.42 27.96,32.42 JP3.3 | JP7.3 29.29,71.25 31.8,71.25 34.58,68.48 34.58,65.96 JP13.3 JP8.3 41.49,70.97 41.49,69.96 42.67,68.78 52.44,68.78 55.16,71.5 JP9.3 55.99,70.97 55.99,69.96 57.17,68.78 66.94,68.78 69.66,71.5 JP10.3 70.49,70.97 70.49,69.96 71.67,68.78 81.44,68.78 84.16,71.5 JP11.3 84.99,70.97 84.99,69.96 86.17,68.78 95.94,68.78 98.66,71.5 JP12.3 99.49,70.97 99.49,69.96 100.67,68.78 110.94,68.78 113.66,71.5 JP14.3 114.49,70.97 114.49,69.96 115.67,68.78 119.87,68.78 121.05,69.96 121.05,70.09 JP6.3 126.99,74.97 126.99,73.96 133.18,67.76 140.82,67.76 X24.1 149.03,57.73 141.79,50.5 v140,50.5 139.75,50.5 | 126.16,32.5 126.25,32.5 126.49,32.74 126.49,33.54 127.67,34.72 131.87,34.72 133.09,33.5 140.05,40.45 140.07,40.48 140.25,40.48 | 126.16,32.5 125.66,32 | 126.16,32.5 126.61,32.96 126.61,33.49 129.71,36.59 U1.1 | U1.1 129.71,42.96 129.75,43 129.75,42.61 U1.1
  Bottom 2: v140.25,40.5 140.25,50.25 v140,50.5
CLK  (via drill 0.3)
  Top 0.3: v45.36,52.49 45.36,51.06 U6.8 | v45.84,62.7 45.84,63.89 45.36,64.36 U2.8 | v61.75,51.06 60.09,51.06 U4.8
  Bottom 0.3: v61.75,51.06 59.85,51.06 57,48.21 49.4,48.21 45.36,52.25 v45.36,52.49 45.36,56.05 45.84,56.52 v45.84,62.7 43.7,64.84 43.7,67.21 43.94,67.45 44.17,67.45 47.26,70.54 47.26,76 50.83,79.56 115.19,79.56 120.65,74.1 120.65,65.08 U3.16
GND  (via drill 3.2)
  Top 0.3: X18.4 143.28,44.42 141.81,44.42 131.5,54.74 131.5,59 132.25,59.75 U1.HEAT | U4.3 U4.4 59.85,56.05 59.38,56.05 58.42,55.1 57.24,55.1 | U4.10 U4.9 59.85,49.88 58.66,49.88 57.24,51.3 57.24,55.1 | U2.9 43.94,64.36 42.99,64.36 U2.10 42.75,64.36 42.75,60.09 | U2.21 50.35,55.1 50.35,56.76 49.4,57.71 44.65,57.71 44.17,57.24 44.17,55.1 U2.16 43.94,54.86 43.94,54.39 43.23,53.67 41.09,53.67 40.38,54.39 40.38,54.86 U2.13 40.38,55.1 40.38,57 42.75,59.38 42.75,60.09 | U2.4 50.59,64.36 51.54,64.36 U2.3 51.77,64.36 51.77,60.09 | 57.24,55.1 54.39,55.1 U2.24 54.15,55.1 54.15,57 51.77,59.38 51.77,60.09 | 43.94,42.27 43.23,42.99 41.09,42.99 40.38,42.27 40.38,41.56 U6.13 | 43.94,42.27 43.94,41.56 U6.16 43.94,42.27 | 50.59,42.27 50.59,41.56 U6.21 50.59,42.27 | 50.59,42.27 51.3,42.99 53.44,42.99 53.67,42.75 | 53.67,42.75 54.15,42.27 54.15,41.56 U6.24 | 43.94,42.27 44.65,42.99 49.88,42.99 50.59,42.27 | 67.21,48.45 67.21,47.5 68.64,46.08 69.35,46.08 U4.13 | 67.21,48.45 68.4,49.64 69.35,49.64 U4.16 69.59,49.88 71.49,49.88 72.2,50.59 72.2,54.15 | 67.21,48.45 60.09,48.45 U4.10 | 50.83,51.06 51.54,51.06 U6.3 | 50.83,51.06 50.59,51.06 U6.4 | 50.83,51.06 50.83,48.92 50.59,48.69 45.84,48.69 44.17,50.35 44.17,50.83 U6.9 43.94,51.06 42.99,51.06 U6.10 42.75,51.06 42.75,51.54 41.8,52.49 36.58,52.49 30.88,46.79 IC2.P$4 | 70.3,56.05 69.59,56.05 U4.21 70.3,56.05 | 72.2,54.15 70.3,56.05 | 72.2,54.15 74.34,54.15 SV1.3 74.5,54 92.5,54 92.5,50 U3.4 | 70.3,56.05 71.72,57.48 71.72,59.38 71.25,59.85 69.59,59.85 U4.24 | IC3.P$4 36.58,29.45 36.57,29.45 | 53.67,42.75 59.38,48.45 59.85,48.45 U4.10
  Top 0.3: 51.77,60.09 42.75,60.09 | 43.64,77.6 43.7,77.66 IC8.P$4 | 95.47,48.35 95.47,41.33 94.76,40.61 90.96,40.61 88.59,42.99 C22.2 | 100.94,14.72 100.8,15.43
  Top 0.5: U3.4 93.58,49.63 94.85,48.35 95.47,48.35 97.62,48.35 LED1.A 101.33,45 103.07,46.75 106.85,46.75 108.59,45 LED2.A 111.08,45 112.82,46.75 128.59,46.75 131.15,44.18 131.15,43.67 U1.2
  Top 2: IC2.P$4 29.51,45.91 25.15,45.91 10.09,30.85 10.09,30.49 IC4.P$4 10.09,29.51 10.09,29.15 20.61,18.62 28.81,18.62 31.38,21.19 31.38,24.25 36.57,29.45 36.6,29.48 37.09,28.99 37.09,28.65 38.29,27.45 45.45,27.45 47.5,29.5 IC5.P$4 51.59,29.01 51.59,28.65 52.79,27.45 59.57,27.45 61.62,29.5 IC6.P$4 66.09,29.01 66.09,28.65 67.29,27.45 74.07,27.45 76.12,29.5 IC17.P$4 80.59,29.01 80.59,28.65 81.79,27.45 88.57,27.45 90.62,29.5 IC18.P$4 95.09,29.01 95.09,28.65 96.29,27.45 103.07,27.45 105.12,29.5 IC16.P$4 109.59,29.01 109.59,28.65 119.61,18.62 128.81,18.62 131.38,21.19 131.38,25.28 IC15.P$4 136.59,29.51 136.59,29.15 137.79,27.95 144.57,27.95 149.03,32.4 X24.2 152.5,57.96 152.5,71 146.5,77 IC1.P$4 143.91,77.49 143.91,77.85 134.39,87.38 125.19,87.38 120.9,83.09 120.9,81.25 IC14.P$4 115.91,77.24 115.91,77.6 114.71,78.8 107.93,78.8 105.88,76.75 IC12.P$4 101.41,77.24 101.41,77.6 100.21,78.8 93.43,78.8 91.38,76.75 IC11.P$4 86.91,77.24 86.91,77.6 85.71,78.8 78.93,78.8 76.88,76.75 IC10.P$4 72.41,77.24 72.41,77.6 71.21,78.8 64.43,78.8 62.38,76.75 IC9.P$4 57.91,77.24 57.91,77.6 56.71,78.8 49.93,78.8 47.88,76.75 IC8.P$4 | IC13.P$4 24.79,66.4 19.16,72.03 19.16,73.24 IC7.P$4 22.62,82.22 22.62,84.81 25.19,87.38 33.39,87.38 43.64,77.6 44.02,77.25 44,77
  Bottom 0.3: U3.29 87.88,65.08 87.88,70.06 88.35,70.54 88.35,75.76 87.4,76.71 IC11.P$4 | U1.2 131.05,43.77 131.05,44.14 130.26,44.93 128.96,44.93 X19.1
  Bottom 2: X24.2 143.16,60.35 U1.HEAT U1.2
  other vias: 127,83
  pour Top (isolate 1.676): 2,104 151.75,103.75 152,103.5 152,2.5 151.75,2.25 2.25,2.25 2,2 2,103.25 1.5,103.75
LOGIC_5V  (via drill 0.3)
  Top 0.3: 135.56,41.8 U1.3 141.27,42.57 141.81,42.02 143.28,42.02 X18.1 | U6.18 U6.19 47.98,41.33 47.98,39.42 | U2.18 46.79,55.1 47.74,55.1 U2.19 47.98,54.86 47.98,54.39 48.69,53.67 51.06,53.67 51.77,54.39 | U2.15 42.99,55.1 42.99,56.76 44.41,58.19 49.64,58.19 51.54,56.29 51.54,55.1 U2.22 | 51.77,54.39 v53.67,52.49 54.15,52.01 54.15,51.06 U6.1 54.15,50.83 54.15,50.35 52.01,48.21 40.14,48.21 | 51.77,54.39 51.77,54.86 U2.22 | 51.77,54.39 U2.22 | 40.14,48.21 40.14,43.23 39.42,42.51 39.42,40.61 40.85,39.19 41.8,39.19 42.75,40.14 | 40.14,48.21 40.14,50.83 U6.12 | 42.75,40.14 42.75,41.33 U6.15 | 51.3,40.38 49.64,38.71 48.69,38.71 47.98,39.42 | 51.3,40.38 51.54,40.61 51.54,41.33 U6.22 | 59.85,45.36 59.85,45.84 U4.12 | 59.85,45.36 53.67,39.19 52.49,39.19 51.3,40.38 | 59.85,45.36 70.54,45.36 70.78,45.6 70.78,47.74 70.06,48.45 69.59,48.45 U4.15 | 42.75,40.14 43.46,40.14 44.65,38.95 47.5,38.95 47.98,39.42 | U4.18 69.59,52.49 69.59,53.44 U4.19 69.35,53.67 60.09,53.67 U4.6 59.85,53.44 58.9,53.44 v58.42,52.96 | v48.92,52.49 47.98,51.54 47.98,51.06 U6.6 | 47.74,65.08 45.36,67.45 42.75,67.45 40.38,65.08 40.38,64.6 U2.12 | 47.74,65.08 47.74,64.6 U2.6 47.74,65.08 | 67.92,57.48 64.36,57.48 61.99,59.85 60.09,59.85 U4.1 59.85,60.09 55.58,64.36 54.39,64.36 U2.1 54.15,64.6 54.15,66.26 53.67,66.74 49.4,66.74 47.74,65.08 | 67.92,57.48 69.35,57.48 U4.22 | 67.92,57.48 67.92,60.33 68.4,60.8 71.01,60.8 72.2,59.61 72.2,58.9 74.34,56.76 SV1.2 74.58,56.76 84.55,56.76 92.62,64.84 U3.27
  Top 0.5: U1.3 134.5,42.86 134.5,49.45 131.25,52.7 117.78,52.7 107.72,62.75 94.96,62.75 U3.27
  Bottom 0.3: 58.42,52.49 59.14,52.49 63.17,56.52 74.34,56.52 SV1.2 | 58.42,52.49 v53.67,52.49 v48.92,52.49 | 58.42,52.49 v58.42,52.96
  Bottom 1: X26.2 149.03,61.93 150.7,60.26 150.7,47.95 141.5,38.75 138.61,38.75 U1.3
MOSI-SDI  (via drill 0.3)
  Top 0.3: v46.79,52.49 46.79,51.06 U6.7 | v46.79,62.7 46.79,64.36 U2.7 | v57.95,51.77 58.42,52.25 59.85,52.25 U4.7
  Bottom 0.3: v46.79,62.7 v46.79,52.49 47.5,51.77 49.4,51.77 | 49.4,51.77 v57.95,51.77 | 49.4,51.77 49.4,48.92 49.64,48.69 56.76,48.69 59.85,51.77 71.01,51.77 72.44,50.35 75.53,50.35 76.47,49.4 76.47,48.92 85.26,40.14 100.94,40.14 107.59,46.79 114.71,46.79 117.33,49.4 118.04,49.4 U3.14
N$1
  Top 2: IC1.P$6 136.78,100.87 X25.1 139.27,101.53 141.57,103.83 143.47,103.83 143.76,103.54 C6.1
N$2
  Top 2: X25.2 142.8,101.24 147.22,101.24 C6.2 148.36,98.46 IC1.P$5
N$3
  Top 2: C1.1 7.04,41.37 X1.1 6.84,44.44 IC2.P$6
N$4
  Top 2: IC2.P$5 9.38,49.52 X1.2 3.98,47.69 1.68,45.39 1.68,43.49 1.96,43.2 C1.2
N$5
  Top 2: X2.1 30.08,2.46 C2.1 44.22,11.68 IC3.P$6
N$6
  Top 2: X2.2 24.81,4.47 27.11,6.78 34.23,6.78 C2.2 36.6,9.14 IC3.P$5
N$7
  Top 2: X3.1 12.44,4.47 C3.1 17.22,9.26 IC4.P$6
N$8
  Top 2: C3.2 13.67,2.46 13.39,2.17 5.78,2.17 X3.2 3.48,6.38 IC4.P$5
N$9
  Top 2: X4.1 50.63,7.54 C4.1 58.72,11.76 IC5.P$6
N$10
  Top 2: IC5.P$5 50.01,12 X4.2 44.31,4.47 46.61,2.17 48.51,2.17 48.8,2.46 C4.2
N$11
  Top 2: X5.1 70.13,7.54 C5.1 73.22,8.32 IC6.P$6
N$12
  Top 2: IC6.P$5 61.98,8.38 X5.2 64.28,2.17 68.01,2.17 68.3,2.46 C5.2
N$13  (via drill 0.3)
  Top 0.3: v41.33,49.16 41.33,50.83 U6.11
  Bottom 0.3: v41.33,49.16 36.1,43.94 32.77,43.94 30.16,41.33 IC2.P$2
N$14  (via drill 0.3)
  Top 0.3: v45.12,39.66 45.12,41.33 U6.17
  Bottom 0.3: v45.12,39.66 45.12,38.48 42.04,35.39 42.04,29.93 41.8,29.69 IC3.P$2
N$15  (via drill 0.3)
  Top 0.3: v41.33,39.9 41.33,41.33 U6.14
  Bottom 0.3: v41.33,39.9 37.29,39.9 33.49,36.1 20.66,36.1 14.72,30.16 IC4.P$2
N$16  (via drill 0.3)
  Top 0.3: v49.16,39.42 49.16,41.33 U6.20
  Bottom 0.3: v49.16,39.42 49.16,36.58 56.05,29.69 IC5.P$2
N$17  (via drill 0.3)
  Top 0.3: v53.2,39.9 53.2,41.33 U6.23
  Bottom 0.3: v53.2,39.9 60.33,39.9 70.54,29.69 IC6.P$2
N$18
  Top 0.3: X18.2 142.04,42.6 141.62,43.02 141.62,43.14 131.49,53.27 118.01,53.27 106.42,64.87 U3.22
N$19
  Bottom 2: JP1.2 33.72,42.5 32.05,40.83 32.05,40.47 30.85,39.27 30.49,39.27 IC2.P$1
N$20
  Bottom 2: JP2.2 43.5,30.59 43.73,30.35 43.73,29.99 IC3.P$1
N$21
  Bottom 2: JP3.2 24.47,32.53 24.47,33.54 23.29,34.72 21.63,34.72 20.45,33.54 20.45,33.23 IC4.P$1
N$22
  Bottom 2: JP4.2 58,30.59 58.23,30.35 58.23,29.99 IC5.P$1
N$23
  Bottom 2: JP5.2 72.5,30.59 72.73,30.35 72.73,29.99 IC6.P$1
N$24
  Bottom 2: JP6.2 129.53,74.97 129.53,73.96 130.71,72.78 132.56,72.78 IC1.P$1
N$25  (via drill 0.3)
  Top 0.3: v50.11,49.4 49.16,50.35 49.16,50.83 U6.5 | v72.67,54.86 73.15,55.34 94.53,55.34 100.22,49.64 U3.7
  Bottom 0.3: v50.11,49.4 56.76,49.4 61.75,54.39 72.2,54.39 v72.67,54.86
N$26  (via drill 0.3)
  Top 0.3: v48.92,60.8 48.92,64.36 U2.5
  Bottom 0.3: v48.92,60.8 48.92,57.71 48.45,57.24 48.45,56.29 49.16,55.58 61.51,55.58 63.65,57.71 99.28,57.71 106.88,50.11 106.88,49.16 106.16,48.45 104.03,48.45 103.08,49.4 U3.8
N$27
  Top 2: IC7.P$6 3.44,98.84 X6.1 5.74,103.83 9.47,103.83 9.76,103.54 C12.1
N$28
  Top 2: X6.2 11.58,98.46 C12.2 16.4,97.56 IC7.P$5
N$29
  Top 2: X7.1 25.5,98.46 C11.1 36.28,96.68 IC8.P$6
N$30
  Top 2: X7.2 32.48,101.53 C11.2 43.9,94.14 IC8.P$5
N$31
  Top 2: X8.1 48.96,94 IC9.P$6 54,97.22 C10.1
N$32
  Top 2: X8.2 48.53,103.54 C10.2 58.4,99.14 IC9.P$5
N$33
  Top 2: X9.1 60.44,100.35 60.7,100.09 60.7,98.58 IC10.P$6 69.74,98.46 C9.1
N$34
  Top 2: X9.2 70.98,101.53 C9.2 73,101.71 75.3,99.41 75.3,96.4 IC10.P$5
N$35
  Top 2: IC11.P$6 79.78,101.18 X10.1 81.95,104.04 C8.1
N$36
  Top 2: C8.2 87.08,98.96 X10.2 87.4,98.64 IC11.P$5
N$37
  Top 2: IC12.P$6 94.28,96.87 X11.1 100.77,101.53 103.07,103.83 110.78,103.83 C7.1
N$38
  Top 2: IC12.P$5 104.02,96.12 X11.2 108.44,101.53 C7.2
N$39  (via drill 0.3)
  Top 0.3: v41.33,56.76 41.33,55.1 U2.14
  Bottom 0.3: v41.33,56.76 41.33,61.51 24.7,78.14 13.54,78.14 11.4,76 IC7.P$2
N$40  (via drill 0.3)
  Top 0.3: v45.12,57 45.12,55.1 U2.17
  Bottom 0.3: v45.12,57 45.12,62.7 43.23,64.6 43.23,68.88 44.89,70.54 44.89,74.1 42.51,76.47 42.51,77.19 41.8,77.9 39.9,77.9 38.95,76.95 IC8.P$2
N$41  (via drill 0.3)
  Top 0.3: v44.41,66.74 43.23,66.74 41.56,65.08 41.56,64.6 U2.11
  Bottom 0.3: v44.41,66.74 49.4,71.72 49.4,77.42 50.11,78.14 52.01,78.14 53.2,76.95 IC9.P$2
N$42  (via drill 0.3)
  Top 0.3: v53.2,66.03 53.2,64.6 U2.2
  Bottom 0.3: v53.2,66.03 54.86,66.03 59.38,70.54 59.38,72.91 64.6,78.14 66.5,78.14 67.69,76.95 IC10.P$2
N$43  (via drill 0.3)
  Top 0.3: v49.16,56.76 49.16,55.1 U2.20
  Bottom 0.3: v49.16,56.76 52.01,56.76 52.73,56.05 61.27,56.05 74.34,69.11 75.76,69.11 78.38,71.72 78.38,77.42 79.09,78.14 80.99,78.14 82.17,76.95 IC11.P$2
N$44  (via drill 0.3)
  Top 0.3: v53.2,56.76 53.2,55.1 U2.23
  Bottom 0.3: v53.2,56.76 61.27,56.76 74.1,69.59 75.53,69.59 77.9,71.96 77.9,77.66 78.85,78.61 95,78.61 96.66,76.95 IC12.P$2
N$45
  Bottom 2: IC7.P$1 9.27,75.51 9.27,75.15 10.47,73.95 17.25,73.95 20.03,76.72 22.29,76.72 23.47,75.54 23.47,74.53 JP7.2
N$46
  Bottom 2: IC8.P$1 36.77,76.26 36.77,75.9 37.97,74.7 41.32,74.7 42.97,73.04 42.97,72.03 JP8.2
N$47
  Bottom 2: IC9.P$1 51.27,76.26 51.27,75.9 52.47,74.7 55.82,74.7 57.47,73.04 57.47,72.03 JP9.2
N$48
  Bottom 2: IC10.P$1 65.77,76.26 65.77,75.9 66.97,74.7 70.32,74.7 71.97,73.04 71.97,72.03 JP10.2
N$49
  Bottom 2: IC11.P$1 80.27,76.26 80.27,75.9 81.47,74.7 84.82,74.7 86.47,73.04 86.47,72.03 JP11.2
N$50
  Bottom 2: IC12.P$1 94.77,76.26 94.77,75.9 95.97,74.7 99.32,74.7 100.97,73.04 100.97,72.03 JP12.2
N$51  (via drill 0.3)
  Top 0.3: v67.92,55.1 60.09,55.1 U4.5
  Bottom 0.3: v67.92,55.1 71.72,55.1 72.2,55.58 73.15,55.58 73.39,55.34 99.75,55.34 105.45,49.64 U3.9
N$52
  Top 2: X14.1 146.94,4.47 C18.1 148.68,7.54 IC15.P$6
N$53
  Top 2: 4.47,63.52 X12.1 | 4.47,63.52 4.47,60.06 C13.1 | IC13.P$6 8.72,59.28 4.47,63.52
N$54
  Top 2: IC13.P$5 7.09,66.9 X12.2 4.47,67.69 2.17,65.39 2.17,57.72 C13.2
N$55
  Top 2: IC14.P$6 110.41,94 X13.1 119.77,101.53 122.07,103.83 130.28,103.83 C14.1
N$56
  Top 2: IC14.P$5 123.02,100.62 X13.2 127.94,101.53 C14.2
N$57
  Top 2: IC15.P$5 137.98,10.62 X14.2 139.81,4.47 142.11,2.17 147.89,2.17 148.17,2.46 C18.2
N$58
  Top 2: C17.1 127.13,7.54 X15.1 124.06,4.66 IC16.P$6
N$59
  Top 2: IC16.P$5 111.26,9.84 112.95,9.84 118.32,4.47 X15.2 121.28,2.17 125.01,2.17 125.3,2.46 C17.2
N$60
  Bottom 0.3: X19.2 120.78,46.71 U3.15
N$61
  Top 2: X16.1 86.35,4.76 | C16.1 90.22,4.76 86.35,4.76 | IC17.P$6 87.72,6.13 86.35,4.76
N$62
  Top 2: IC17.P$5 80.1,5.36 X16.2 83.28,2.17 87.01,2.17 87.3,2.46 C16.2
N$63
  Top 2: X17.1 108.13,7.54 C15.1 106.68,7.54 IC18.P$6
N$64
  Top 2: IC18.P$5 99.98,6.62 X17.2 102.28,2.17 106.01,2.17 106.3,2.46 C15.2
N$65
  Top 0.3: U3.21 119.2,53.75 131.69,53.75 141.81,43.62 143.28,43.62 X18.3
N$66  (via drill 0.3)
  Top 0.3: v61.75,58.9 60.09,58.9 U4.2
  Bottom 0.3: v61.75,58.9 62.23,58.9 73.86,70.54 73.86,74.34 78.61,79.09 109.01,79.09 111.15,76.95 IC14.P$2
N$67  (via drill 0.3)
  Top 0.3: v71.49,53.67 70.3,54.86 69.59,54.86 U4.20
  Bottom 0.3: v71.49,53.67 72.44,53.67 73.39,52.73 99.04,52.73 101.65,50.11 101.65,49.16 102.84,47.98 113.29,47.98 114.47,49.16 114.47,50.11 115.19,50.83 118.75,50.83 119.46,50.11 119.46,40.85 127.06,33.25 127.06,30.64 129.68,28.02 139.18,28.02 141.07,29.93 IC15.P$2
N$68  (via drill 0.3)
  Top 0.3: v71.01,50.59 70.54,51.06 69.59,51.06 U4.17
  Bottom 0.3: v71.01,50.59 71.01,50.11 73.62,47.5 75.76,47.5 79.8,43.46 79.8,42.51 85.5,36.81 106.16,36.81 113.29,29.69 114,29.69 IC16.P$2
N$69  (via drill 0.3)
  Top 0.3: v66.5,47.26 60.09,47.26 U4.11
  Bottom 0.3: v66.5,47.26 67.45,47.26 85.03,29.69 IC17.P$2
N$70  (via drill 0.3)
  Top 0.3: v67.92,47.98 68.4,47.5 69.35,47.5 U4.14
  Bottom 0.3: v67.92,47.98 70.54,47.98 82.17,36.34 92.86,36.34 99.51,29.69 IC18.P$2
N$71
  Bottom 2: IC13.P$1 30.78,58.78 32.28,60.28 32.28,61.29 33.46,62.47 34.47,62.47 JP13.2
N$72
  Bottom 2: IC14.P$1 109.27,76.26 109.27,75.9 110.47,74.7 114.32,74.7 115.97,73.04 115.97,72.03 JP14.2
N$73
  Top 0.5: LED1.K 107.06,45 C19.1
N$74
  Top 0.5: LED2.K 110.5,42.23 C20.1
N$75  (via drill 0.3)
  Top 0.3: v71.01,58.9 69.59,58.9 U4.23
  Bottom 0.3: v71.01,58.9 71.96,58.9 76.71,63.65 125.88,63.65 139.18,76.95 IC1.P$2
N$76
  Top 0.3: U6.2 52.96,51.06 52.96,51.54 51.3,53.2 37.76,53.2 29.69,61.27 IC13.P$2
N$77
  Bottom 2: IC15.P$1 143.11,30.61 143.11,30.8 141.98,31.93 134.35,31.93 131.82,29.4 130.26,29.4 128.87,30.8 128.87,31.64 JP15.2
N$78
  Bottom 2: JP16.2 116.5,29.72 IC16.P$1
N$79
  Bottom 2: JP17.2 87,30.59 87.23,30.35 87.23,29.99 IC17.P$1
N$80
  Bottom 2: JP18.2 101.5,30.59 101.73,30.35 101.73,29.99 IC18.P$1
N$81
  Bottom 0.3: JP19.3 91.67,45.84 90.25,45.84 87.64,48.45 86.21,48.45 85.26,49.4 U3.1
N$83  (via drill 3.2)
  other vias: 127,23
N$84  (via drill 3.2)
  other vias: 27,23
N$85  (via drill 3.2)
  other vias: 27,83
N$87
  Bottom 0.3: JP19.1 96.9,45.84 96.9,48.45 97.85,49.4 U3.6
N$88
  Top 0.3: C21.1 88.59,46.08 89.78,46.08 91.2,47.5 92.39,47.5 94.05,45.84 JP19.2
N$89
  Bottom 0.3: JP20.1 96.66,42.51 96.66,43.7 95.47,44.89 95.47,49.4 U3.5
N$90
  Bottom 0.3: JP20.2 94.05,42.27 92.39,40.61 87.88,40.61 77.19,51.3 74.58,51.3 SV1.4
RX
  Top 0.3: C22.1 80.99,43.23 80.99,45.84 C21.2 80.75,46.08 77.9,48.92 74.58,48.92 SV1.5
TX
  Top 0.3: JP20.3 91.67,42.51 90.49,42.51 87.4,45.6 87.4,49.16 87.64,49.4 U3.2

### Text on the board
tPlace: + | + | + | + | + | + | + | - | - | - | - | - | - | - | - | 11 | 12 | 13 | 14 | 15 | 16 | 17 | 18 | + | RCD / Control / Board | AD3 | AD3 | AD1 | AD1 | AD1 | AD1 | AD1 | AD1 | + | 12 | 15 | 17 | 18 | 11 | 13 | 14 | 16 | - | 10 | P1 IN P2 | P2 IN P1 | P1 IN P2 | P1 IN P2 | P1 IN P2 | P1 IN P2 | P1 IN P2 | P1 IN P2 | V_P2 | P2 IN P1 | V1.0 | LOG_5V | AD2 | BT | 10 | + | V_P1 | AD1 | NANO V3 | - | 5V | GND | GND | 9 | Studio Prade | TX | AD3 | RX | 1K | V_P1->LOG_5V | GND | P1 IN P2 | AD2 | SDA | SCL | LOG_5V | AD2 | 2K | 9 | 2018 | 2018 | 1K | V_P2 | + | V_P1 | P1 IN P2 | P1 IN P2 | P1 IN P2 | P1 IN P2 | P1 IN P2 | 1K | P1 IN P2 | Button | P1 IN P2 | P2 IN P1 | AD3 | AD2 | AD2 | AD2 | AD2 | AD3 | AD3 | AD3 | 8 | 7 | 6 | 5 | 4 | 3 | 2 | 1 | - | 8 | 18 CHN | 7 | 6 | 5 | 4 | 3 | 2 | 2 | 1 | + | + | + | + | + | + | + | + | - | - | - | - | - | - | -